# EAGLE design GroundStation_revA (EAGLE 9.6.2)

## Sheet 1 of 4: RN2483
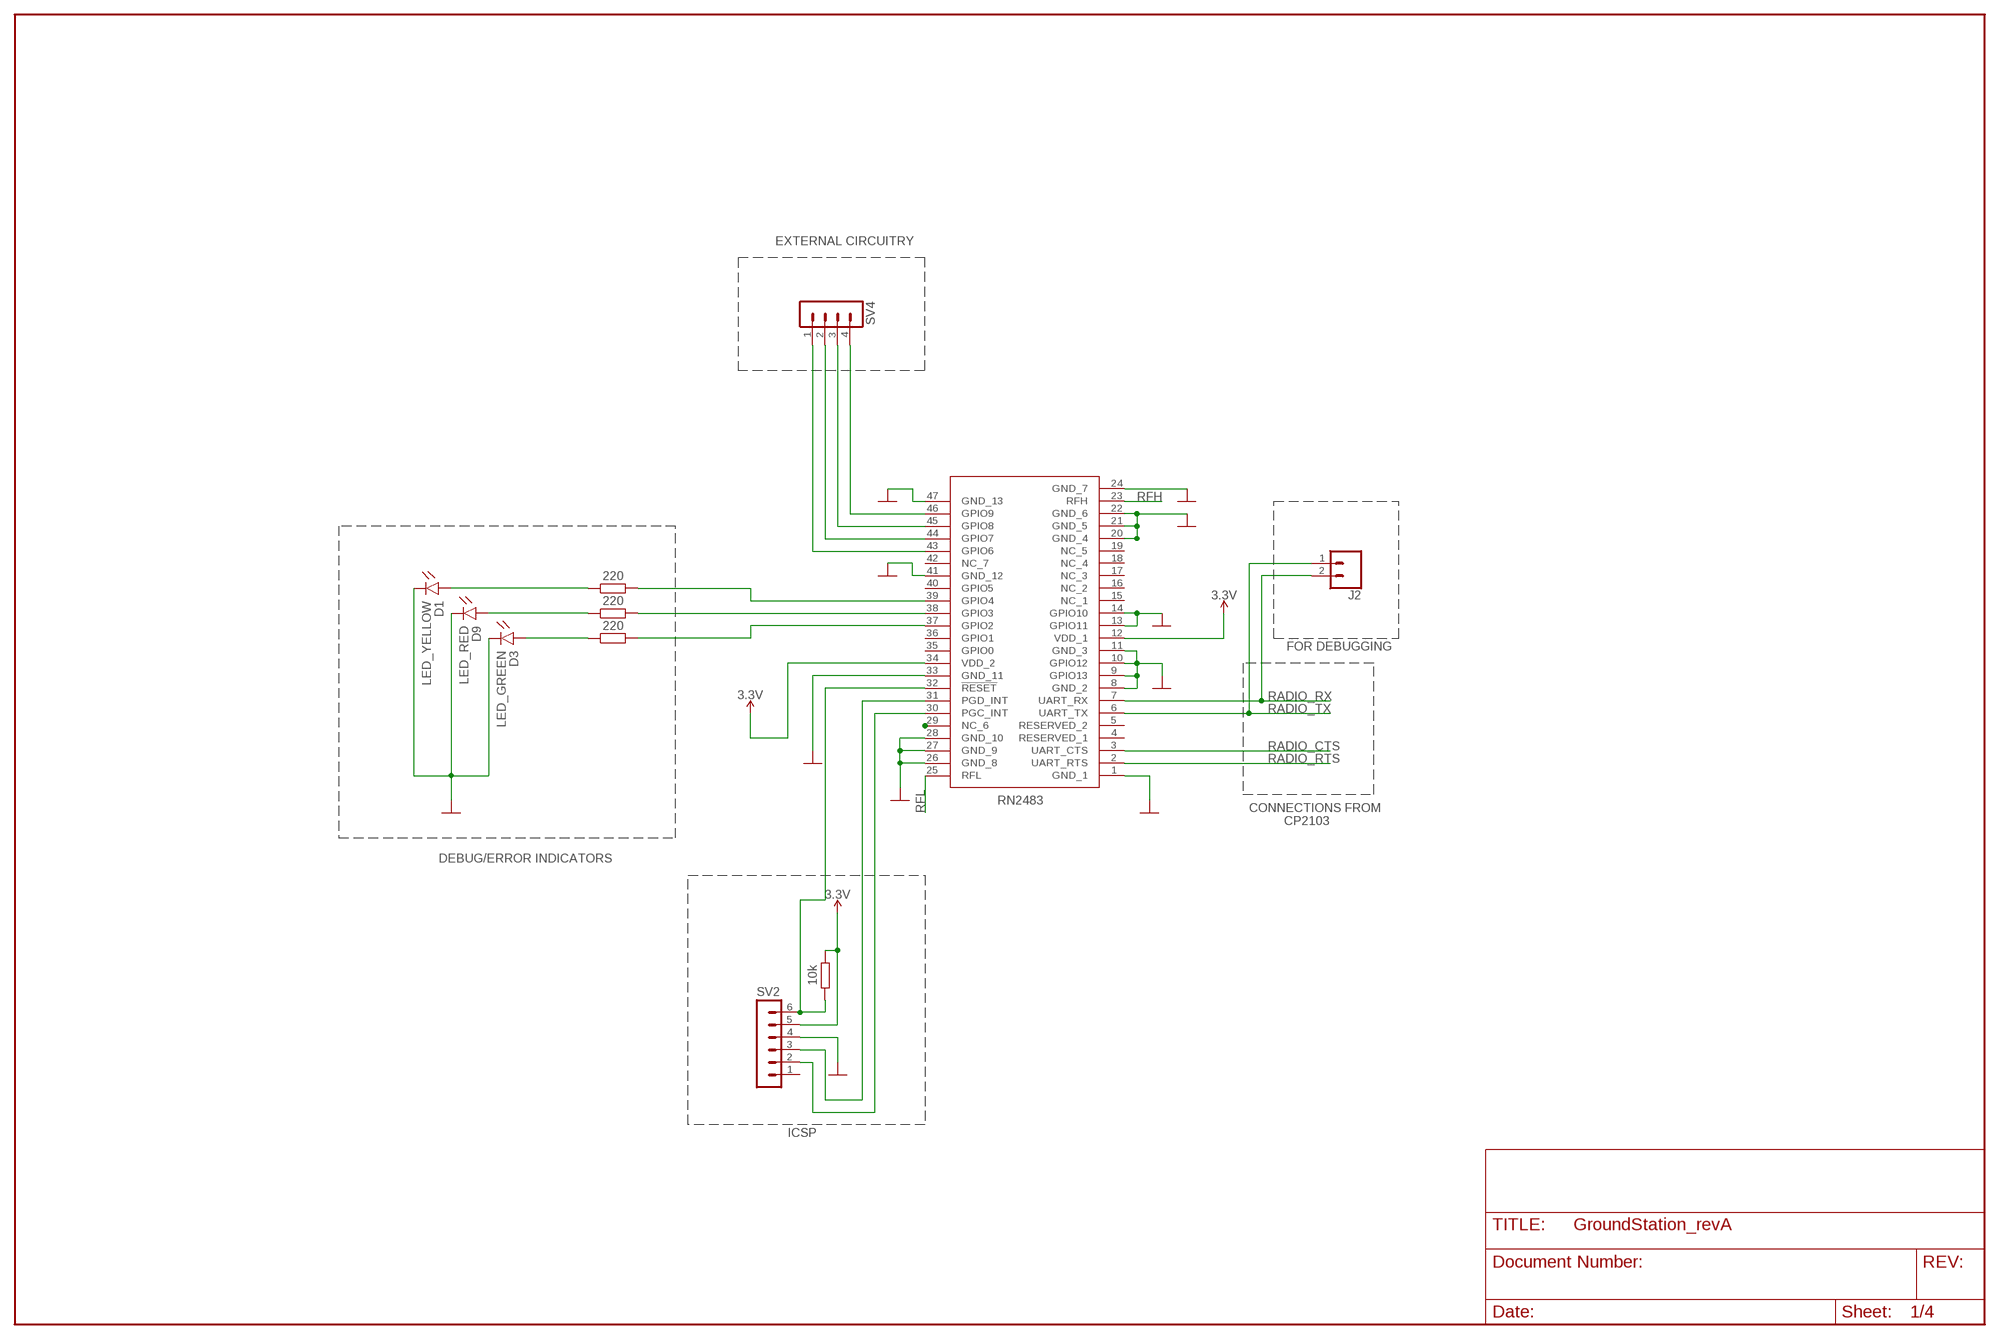
[diagram p0: schematic, sheet 1]

### Parts
D1  LED_YELLOW  CHIP-FLAT-Y_0603-0.55MM  [LEDC1608X55N_FLAT-Y]
D3  LED_GREEN  CHIP-FLAT-G_0603-0.55MM  [LEDC1608X55N_FLAT-G]
D9  LED_RED  CHIP-FLAT-R_0603-0.55MM  [LEDC1608X55N_FLAT-R]
J2  CONN_02  [1X02]
R12  10k  R_CHIP-0603(1608-METRIC)  [RESC1608X60]
R14  220  R_CHIP-0603(1608-METRIC)  [RESC1608X60]
R15  220  R_CHIP-0603(1608-METRIC)  [RESC1608X60]
R16  220  R_CHIP-0603(1608-METRIC)  [RESC1608X60]
RN2483  RN2483A-I_RM104  [RN2483AIRM104]
SV2  MA06-1  [MA06-1]
SV4  MA04-1  [MA04-1]

### Nets
3.3V: R12.1 RN2483.12(VDD_1) RN2483.34(VDD_2) SV2.5 ; also sheet 2
D2: D9.A R15.1
GND: D1.C D3.C D9.C RN2483.1(GND_1) RN2483.8(GND_2) RN2483.9(GPIO13) RN2483.10(GPIO12) RN2483.11(GND_3) RN2483.13(GPIO11) RN2483.14(GPIO10) RN2483.20(GND_4) RN2483.21(GND_5) RN2483.22(GND_6) RN2483.24(GND_7) RN2483.26(GND_8) RN2483.27(GND_9) RN2483.28(GND_10) RN2483.33(GND_11) RN2483.41(GND_12) RN2483.47(GND_13) SV2.4 ; also sheet 2,3,4
GPIO_2: R14.2 RN2483.37(GPIO2)
GPIO_3: R15.2 RN2483.38(GPIO3)
GPIO_4: R16.2 RN2483.39(GPIO4)
GPIO_6: RN2483.43(GPIO6) SV4.1
GPIO_7: RN2483.44(GPIO7) SV4.2
GPIO_8: RN2483.45(GPIO8) SV4.3
GPIO_9: RN2483.46(GPIO9) SV4.4
N$45: RN2483.29(NC_6)
N$53: D3.A R14.1
N$55: D1.A R16.1
PCG_INT: RN2483.30(PGC_INT) SV2.2
PGD_INT: RN2483.31(PGD_INT) SV2.3
RADIO_CTS: RN2483.3(UART_CTS) ; also sheet 2
RADIO_RTS: RN2483.2(UART_RTS) ; also sheet 2
RADIO_RX: J2.2 RN2483.7(UART_RX) ; also sheet 2
RADIO_TX: J2.1 RN2483.6(UART_TX) ; also sheet 2
RFH: RN2483.23(RFH) ; also sheet 4
RFL: RN2483.25(RFL) ; also sheet 4
RN2483_RESET: R12.2 RN2483.32(!RESET) SV2.6
Unconnected: RN2483.4(RESERVED_1) RN2483.5(RESERVED_2) RN2483.15(NC_1) RN2483.16(NC_2) RN2483.17(NC_3) RN2483.18(NC_4) RN2483.19(NC_5) RN2483.35(GPIO0) RN2483.36(GPIO1) RN2483.40(GPIO5) RN2483.42(NC_7) SV2.1

### Notes on the sheet
- EXTERNAL CIRCUITRY
- FOR DEBUGGING
- CONNECTIONS FROM
            CP2103
- DEBUG/ERROR INDICATORS
- ICSP

## Sheet 2 of 4: CP2103
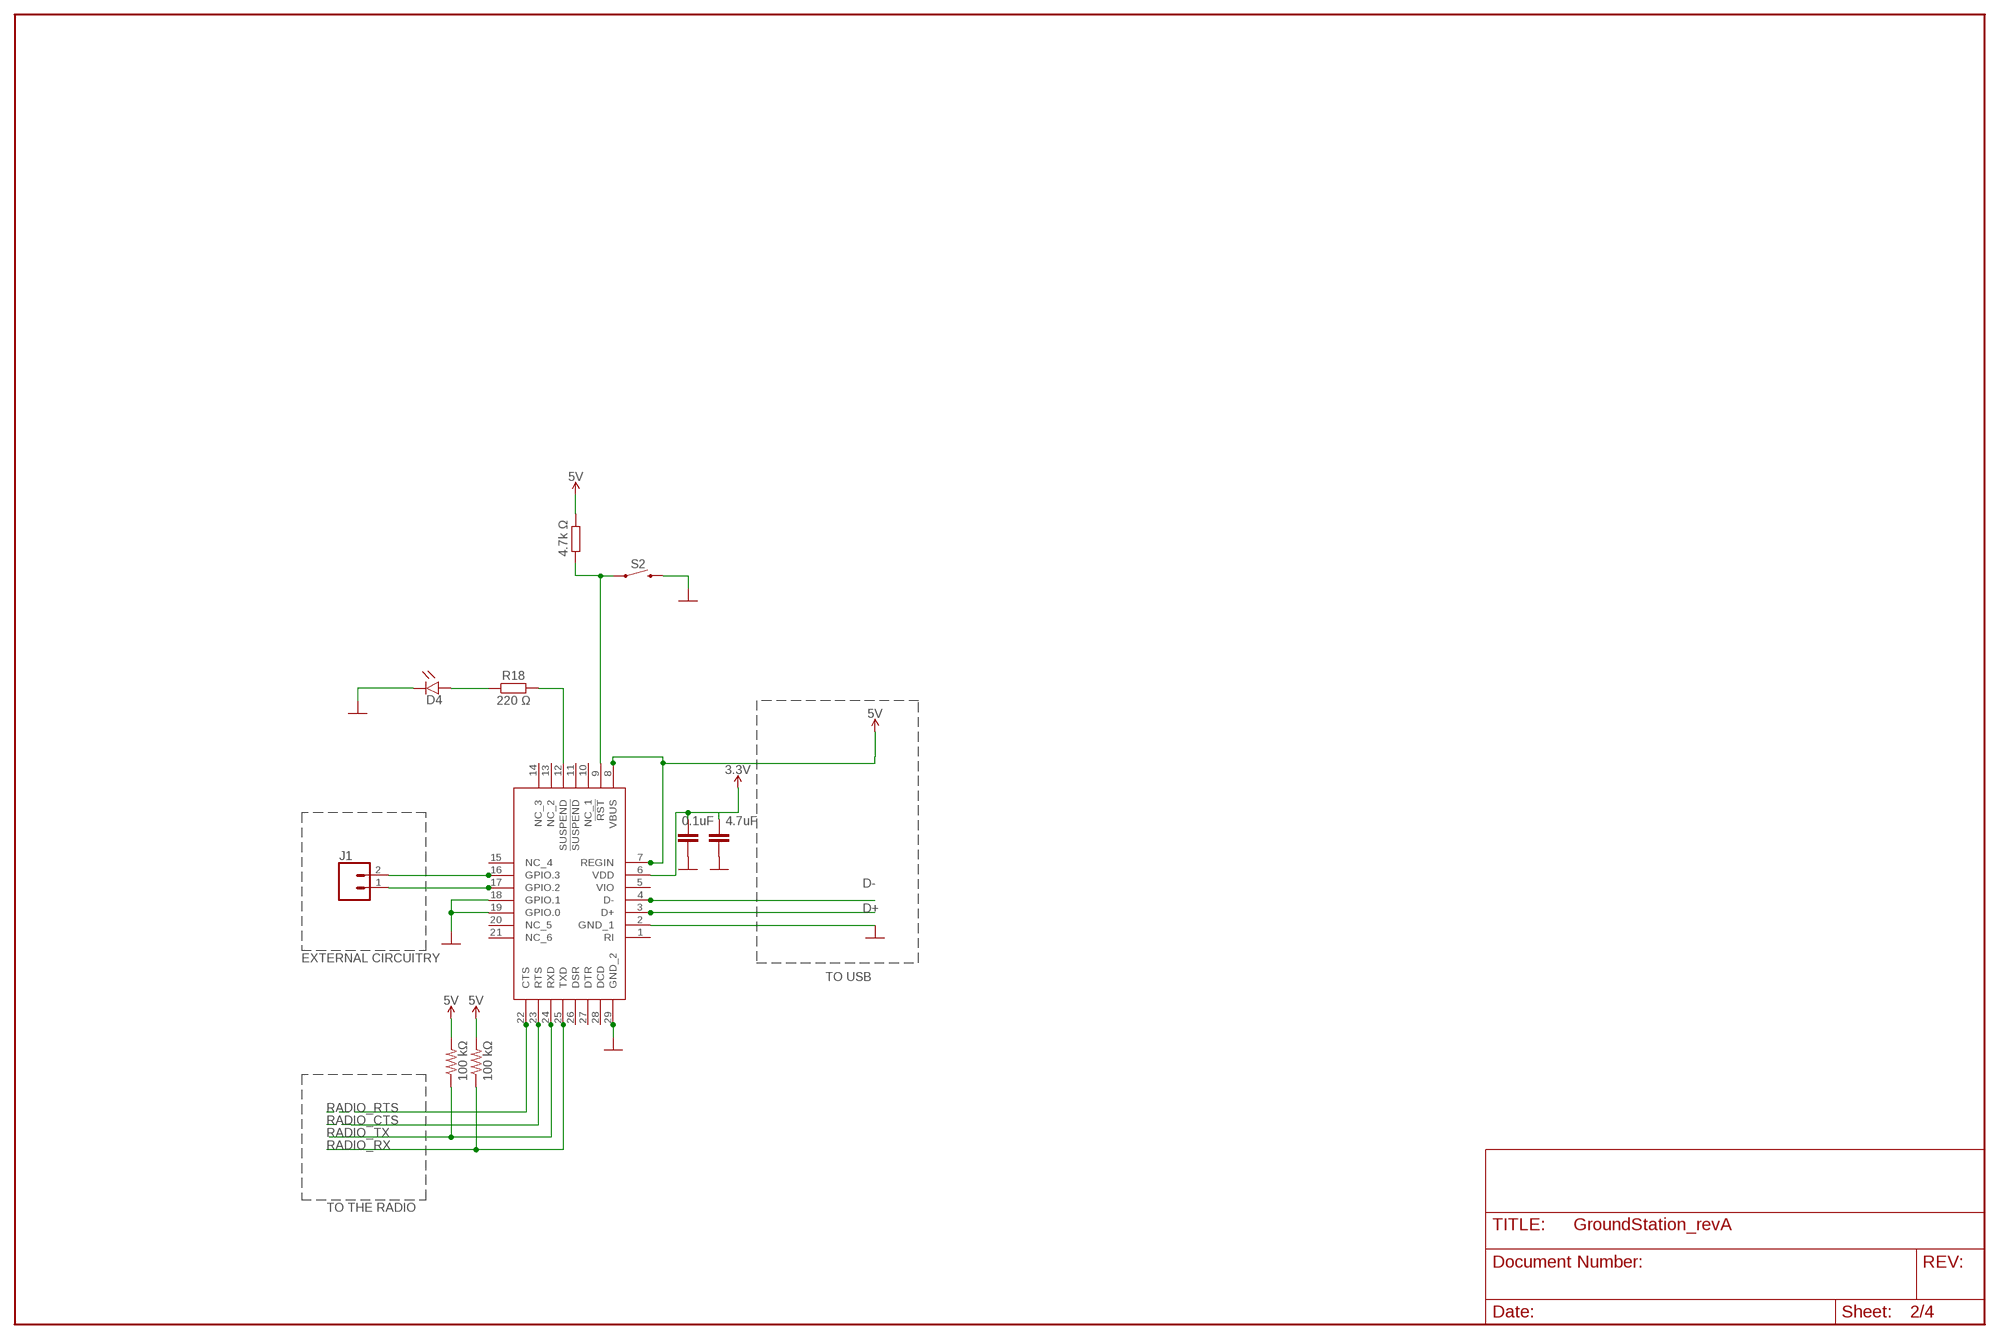
[diagram p1: schematic, sheet 2]

### Parts
C7  0.1uF  C_CHIP-0805(2012-METRIC)  [CAPC2012X110]
C9  4.7uF  C_CHIP-0805(2012-METRIC)  [CAPC2012X110]
D4  LED_RED  CHIP-FLAT-R_0603-0.55MM  [LEDC1608X55N_FLAT-R]
IC4  CP2103-GM  [QFN50P500X500X100-29N]
J1  CONN_02  [1X02]
R1  100 kΩ  R-US_R0805  [R0805]
R9  100 kΩ  R-US_R0805  [R0805]
R17  4.7k Ω  R_CHIP-0603(1608-METRIC)  [RESC1608X60]
R18  220 Ω  R_CHIP-0603(1608-METRIC)  [RESC1608X60]
S2  MOMENTARY-SWITCH-SPST-PTH-6.0MM-KIT  [TACTILE_SWITCH_PTH_6.0MM_KIT]

### Nets
3.3V: C7.1 C9.1 IC4.6(VDD) ; also sheet 1
CP2103_GPIO2: IC4.17(GPIO.2) J1.1
CP2103_GPIO3: IC4.16(GPIO.3) J1.2
CP2103_RST: IC4.9(!RST) R17.2 S2.1
D+: IC4.3(D+) ; also sheet 3
D-: IC4.4(D-) ; also sheet 3
GND: C7.2 C9.2 D4.C IC4.2(GND_1) IC4.18(GPIO.1) IC4.19(GPIO.0) IC4.29(GND_2) S2.3 ; also sheet 1,3,4
N$68: D4.A R18.1
RADIO_CTS: IC4.23(RTS) ; also sheet 1
RADIO_RTS: IC4.22(CTS) ; also sheet 1
RADIO_RX: IC4.25(TXD) R9.1 ; also sheet 1
RADIO_TX: IC4.24(RXD) R1.1 ; also sheet 1
SUSPEND: IC4.12(SUSPEND) R18.2
V_BUS: IC4.7(REGIN) IC4.8(VBUS) R1.2 R9.2 R17.1 ; supply symbol labelled 5V ; also sheet 3
Unconnected: IC4.1(RI) IC4.5(VIO) IC4.10(NC_1) IC4.11(!SUSPEND) IC4.13(NC_2) IC4.14(NC_3) IC4.15(NC_4) IC4.20(NC_5) IC4.21(NC_6) IC4.26(DSR) IC4.27(DTR) IC4.28(DCD)

### Notes on the sheet
- EXTERNAL CIRCUITRY
- TO USB
- TO THE RADIO

## Sheet 3 of 4: USB PORT
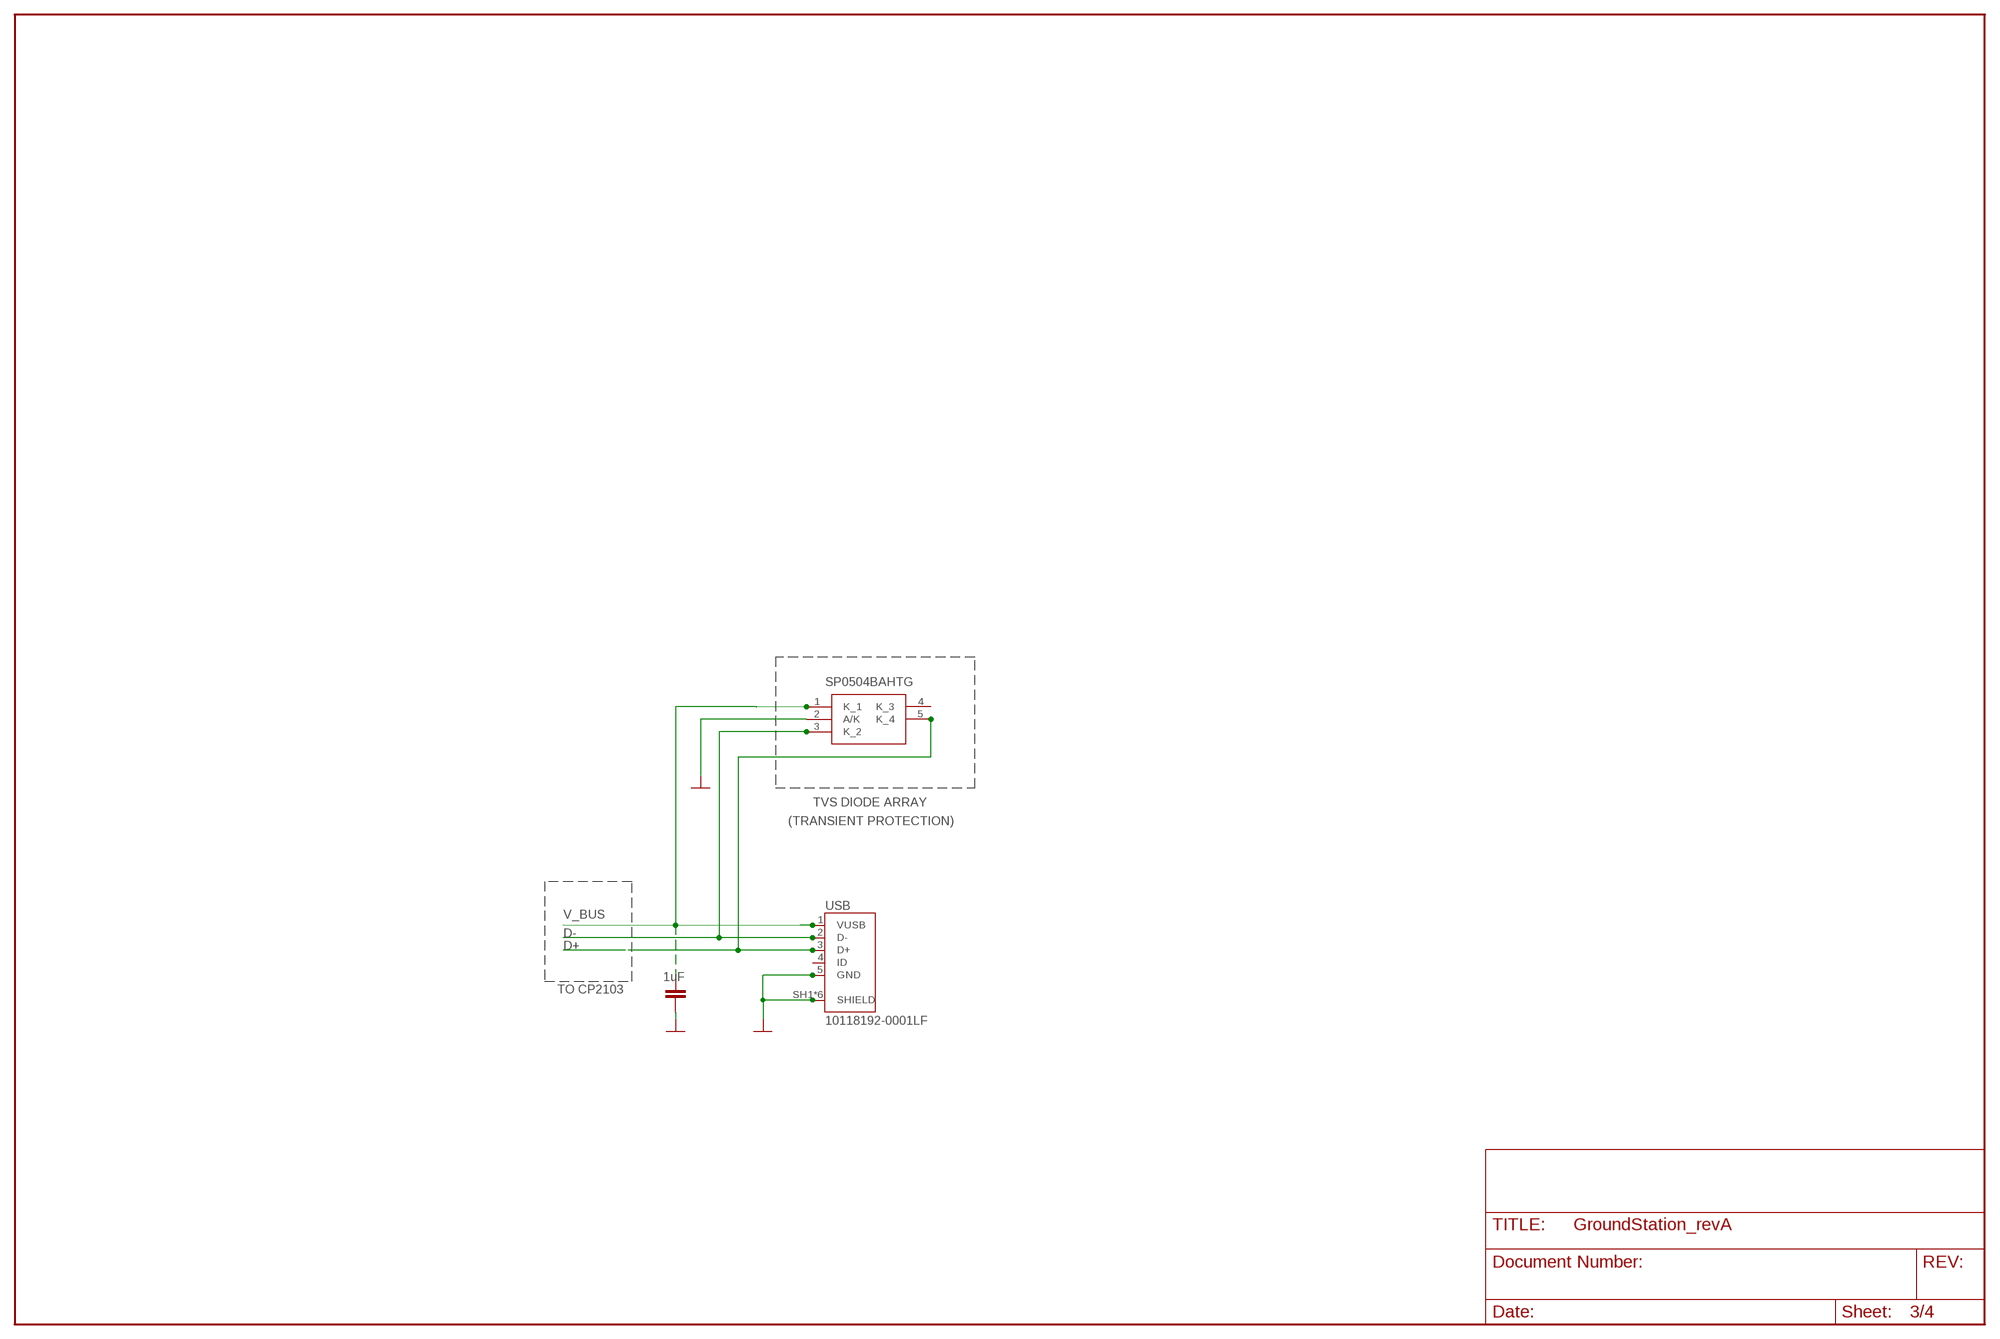
[diagram p2: schematic, sheet 3]

### Parts
C8  1uF  C_CHIP-0805(2012-METRIC)  [CAPC2012X110]
IC6  SP0504BAHTG  [SOT95P280X145-5N]
USB  10118192-0001LF  [10118192-0001LF]

### Nets
D+: IC6.5(K_4) USB.3(D+) ; also sheet 2
D-: IC6.3(K_2) USB.2(D-) ; also sheet 2
GND: C8.2 IC6.2(A/K) USB.5(GND) USB.SH1(SHIELD) USB.SH2(SHIELD) USB.SH3(SHIELD) USB.SH4(SHIELD) USB.SH5(SHIELD) USB.SH6(SHIELD) ; also sheet 1,2,4
V_BUS: C8.1 IC6.1(K_1) USB.1(VUSB) ; also sheet 2
Unconnected: IC6.4(K_3) USB.4(ID)

### Notes on the sheet
- TVS DIODE ARRAY
- (TRANSIENT PROTECTION)
- TO CP2103

## Sheet 4 of 4: SMA CONNECTORS
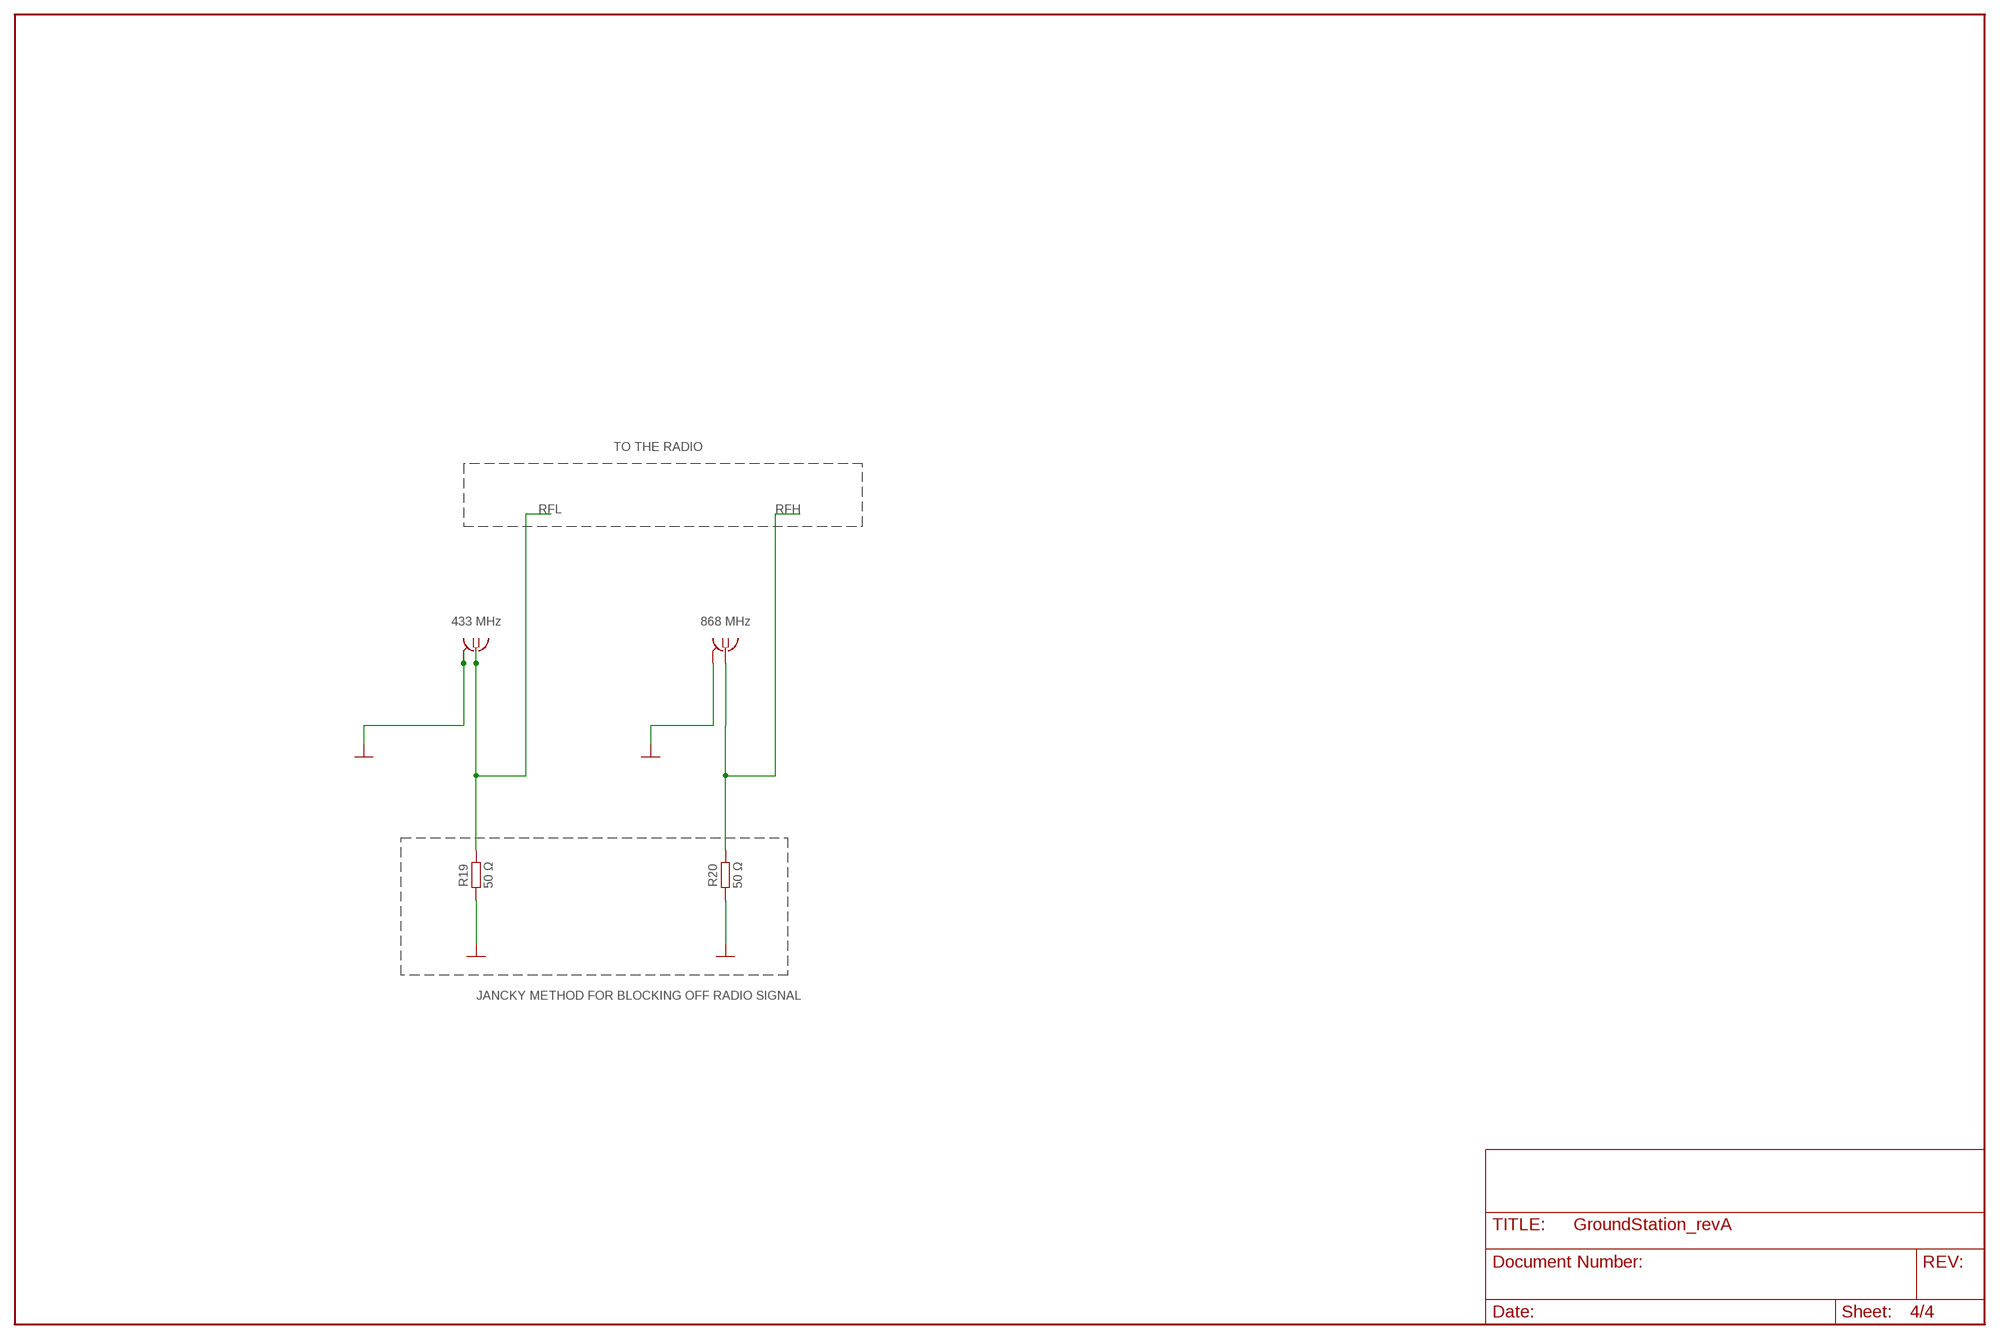
[diagram p3: schematic, sheet 4]

### Parts
ANT1  5MMSMA  [5MMSMA]
ANT2  5MMSMA  [5MMSMA]
R19  50 Ω  R_CHIP-0603(1608-METRIC)  [RESC1608X60]
R20  50 Ω  R_CHIP-0603(1608-METRIC)  [RESC1608X60]

### Nets
GND: ANT1.GND ANT1.GND2(GND) ANT2.GND ANT2.GND2(GND) R19.1 R20.1 ; also sheet 1,2,3
RFH: ANT2.RF R20.2 ; also sheet 1
RFL: ANT1.RF R19.2 ; also sheet 1

### Notes on the sheet
- TO THE RADIO
- 433 MHz | 868 MHz
- JANCKY METHOD FOR BLOCKING OFF RADIO SIGNAL

## Library data of the parts
ANT1 ANT2 = CUINSPACE_Managed:5MMSMA
C7-C9 = Capacitor:C: Capacitor - Generic; CATEGORY: Capacitor
D1 = LED:CHIP-FLAT-Y; CATEGORY: LED; COLOR: YELLOW; DESCRIPTION: CHIP LED FLAT; SUB-CATEGORY: CHIP; TYPE: FLAT_TOP
D3 = LED:CHIP-FLAT-G; CATEGORY: LED; COLOR: GREEN; DESCRIPTION: CHIP LED FLAT; SUB-CATEGORY: CHIP; TYPE: FLAT_TOP
D4 D9 = LED:CHIP-FLAT-R; CATEGORY: LED; COLOR: RED; DESCRIPTION: CHIP LED FLAT; SUB-CATEGORY: CHIP; TYPE: FLAT_TOP
IC4 = CP2103-GM:CP2103-GM: IC,Converter,USB - UART Bridge,CP2103-GM Silicon Labs CP2103-GM, USB Controller, 12MBps, USB to UART, 3.3 V, 28-Pin QFN Source: Datasheet <https://www.silabs.com/documents/public/data-sheets/CP2103.pdf>; ARROW_PART_NUMBER: CP2103-GM; ARROW_PRICE-STOCK: https://www.arrow.com/en/products/cp2103-gm/silicon-labs?region=nac; DESCRIPTION: IC,Converter,USB - UART Bridge,CP2103-GM Silicon Labs CP2103-GM, USB Controller, 12MBps, USB to UART, 3.3 V, 28-Pin QFN; HEIGHT: 1mm; MANUFACTURER_NAME: Silicon Labs; MANUFACTURER_PART_NUMBER: CP2103-GM; MOUSER_PART_NUMBER: 634-CP2103-GM; MOUSER_PRICE-STOCK: https://www.mouser.co.uk/ProductDetail/Silicon-Labs/CP2103-GM?qs=yHCtFi5ROqIZGxXx3OFcgw%3D%3D
IC6 = SP0504BAHTG:SP0504BAHTG: Littelfuse SP0504BAHTG Quad Uni-Directional TVS Diode Array, 0.225W peak, 5-Pin SOT-23 Source: Datasheet <http://componentsearchengine.com/Datasheets/1/SP0504BAHTG.pdf>; ARROW_PART_NUMBER: SP0504BAHTG; ARROW_PRICE-STOCK: https://www.arrow.com/en/products/sp0504bahtg/littelfuse; DESCRIPTION: Littelfuse SP0504BAHTG Quad Uni-Directional TVS Diode Array, 0.225W peak, 5-Pin SOT-23; HEIGHT: 1.45mm; MANUFACTURER_NAME: LITTELFUSE; MANUFACTURER_PART_NUMBER: SP0504BAHTG; MOUSER_PART_NUMBER: 576-SP0504BAHTG; MOUSER_PRICE-STOCK: https://www.mouser.co.uk/ProductDetail/Littelfuse/SP0504BAHTG?qs=zR8PVLWe1trv9sWzoBaD%252Bg%3D%3D
J1 J2 = SparkFun-Connectors:CONN_02: Multi connection point. Often used as Generic Header-pin footprint for 0.1 inch spaced/style header connections On any of the 0.1 inch spaced packages, you can populate with these: Break Away Headers - Straight <https://www.sparkfun.com/products/116> (PRT-00116) Break Away Male Headers - Right Angle <https://www.sparkfun.com/products/553> (PRT-00553) Female Headers <https://www.sparkfun.com/products/115> (PRT-00115) Break Away Headers - Machine Pin <https://www.sparkfun.com/products/117> (PRT-00117) Break Away Female Headers - Swiss Machine Pin <https://www.sparkfun.com/products/743> (PRT-00743) For SCREWTERMINALS and SPRING TERMINALS visit here: Screw Terimnals on SparkFun.com <https://www.sparkfun.com/search/results?term=Screw+Terminals> (5mm/3.5mm/2.54mm spacing) This device is also useful as a general connection point to wire up your design to another part of your project. Our various solder wires solder well into these plated through hole pads. Hook-Up Wire - Assortment (Stranded, 22 AWG) <https://www.sparkfun.com/products/11375> (PRT-11375) Hook-Up Wire - Assortment (Solid Core, 22 AWG) <https://www.sparkfun.com/products/11367> (PRT-11367) View the entire wire category on our website here <https://www.sparkfun.com/categories/141> Special notes: Molex polarized connector foot print use with: PRT-08233 with associated crimp pins and housings. 2.54_SCREWTERM for use with PRT-10571. 3.5mm Screw Terminal footprints for PRT-08084 5mm Screw Terminal footprints for use with PRT-08432
R1 R9 = rcl:R-US_: RESISTOR, American symbol; SPICEPREFIX: R
R12 R14-R20 = Resistor:R: Resistor Fixed - Generic; CATEGORY: Resistor; SUB-CATEGORY: Fixed
RN2483 = RN2483A-I_RM104:RN2483A-I_RM104: MICROCHIP - RN2483A-I/RM104 - TRANSCEIVER MODULE, 300KBPS, 870MHZ Source: Datasheet <https://www.arrow.com/en/products/rn2483a-irm104/microchip-technology>; ARROW_PART_NUMBER: RN2483A-I/RM104; ARROW_PRICE-STOCK: https://www.arrow.com/en/products/rn2483a-irm104/microchip-technology?region=nac; DESCRIPTION: MICROCHIP - RN2483A-I/RM104 - TRANSCEIVER MODULE, 300KBPS, 870MHZ; HEIGHT: 3.34mm; MANUFACTURER_NAME: Microchip; MANUFACTURER_PART_NUMBER: RN2483A-I/RM104; MOUSER_PART_NUMBER: 579-RN2483A-I/RM104; MOUSER_PRICE-STOCK: https://www.mouser.co.uk/ProductDetail/Microchip-Technology/RN2483A-I-RM104?qs=F5EMLAvA7ICI%2FFS0wekTjA%3D%3D
S2 = SparkFun-Switches:MOMENTARY-SWITCH-SPST: Momentary Switch (Pushbutton) - SPST Normally-open (NO) SPST momentary switches (buttons, pushbuttons). Variants PTH-12MM - 12mm square, through-hole Momentary Pushbutton Switch - 12mm Square <https://www.sparkfun.com/products/9190> (COM-09190) PTH-6.0MM, PTH-6.0MM-KIT - 6.0mm square, through-hole Mini Pushbutton Switch <https://www.sparkfun.com/products/97> (COM-00097) KIT package intended for soldering kit's - only one side of pads' copper is exposed. PTH-RIGHT-ANGLE-KIT - Right-angle, through-hole Right Angle Tactile Button <https://www.sparkfun.com/products/10791> - Used on SparkFun BigTime Watch Kit <https://www.sparkfun.com/products/11734> SMD-12MM - 12mm square, surface-mount Tactile Button - SMD (12mm) <https://www.sparkfun.com/products/12993> (COM-12993) Used on SparkFun PicoBoard <https://www.sparkfun.com/products/11888> SMD-4.5MM - 4.5mm Square Trackball Switch Used on SparkFun Blackberry Trackballer Breakout <https://www.sparkfun.com/products/13169> SMD-4.6MMX2.8MM - 4.60mm x 2.80mm, surface mount Used on SparkFun SAMD21 Mini Breakout <https://www.sparkfun.com/products/13664> SMD-5.2MM, SMD-5.2-REDUNDANT - 5.2mm square, surface-mount Mini Pushbutton Switch - SMD <https://www.sparkfun.com/products/8720> (COM-08720) Used on Arduino Pro Mini <https://www.sparkfun.com/products/11114> REDUNDANT package connects both switch circuits together SMD-6.0X3.5MM - 6.0 x 3.5mm, surface mount Momentary Reset Switch SMD <https://www.sparkfun.com/products/8229> (COM-08229) SMD-6.2MM-TALL - 6.2mm square, surface mount Tactile Button - SMD (6mm) <https://www.sparkfun.com/products/12992> Used on SparkFun Digital Sandbox <https://www.sparkfun.com/products/12651> SMD-RIGHT-ANGLE - Right-angle, surface mount Used on SparkFun Block for Intel® Edison - Arduino <https://www.sparkfun.com/products/13036>; PROD_ID: SWCH-08441; SF_SKU: COM-00097
SV2 = con-lstb:MA06-1: PIN HEADER; OC_FARNELL: unknown; OC_NEWARK: unknown
SV4 = con-lstb:MA04-1: PIN HEADER; OC_FARNELL: unknown; OC_NEWARK: unknown
USB = MCU Board:10118192-0001LF

## Board
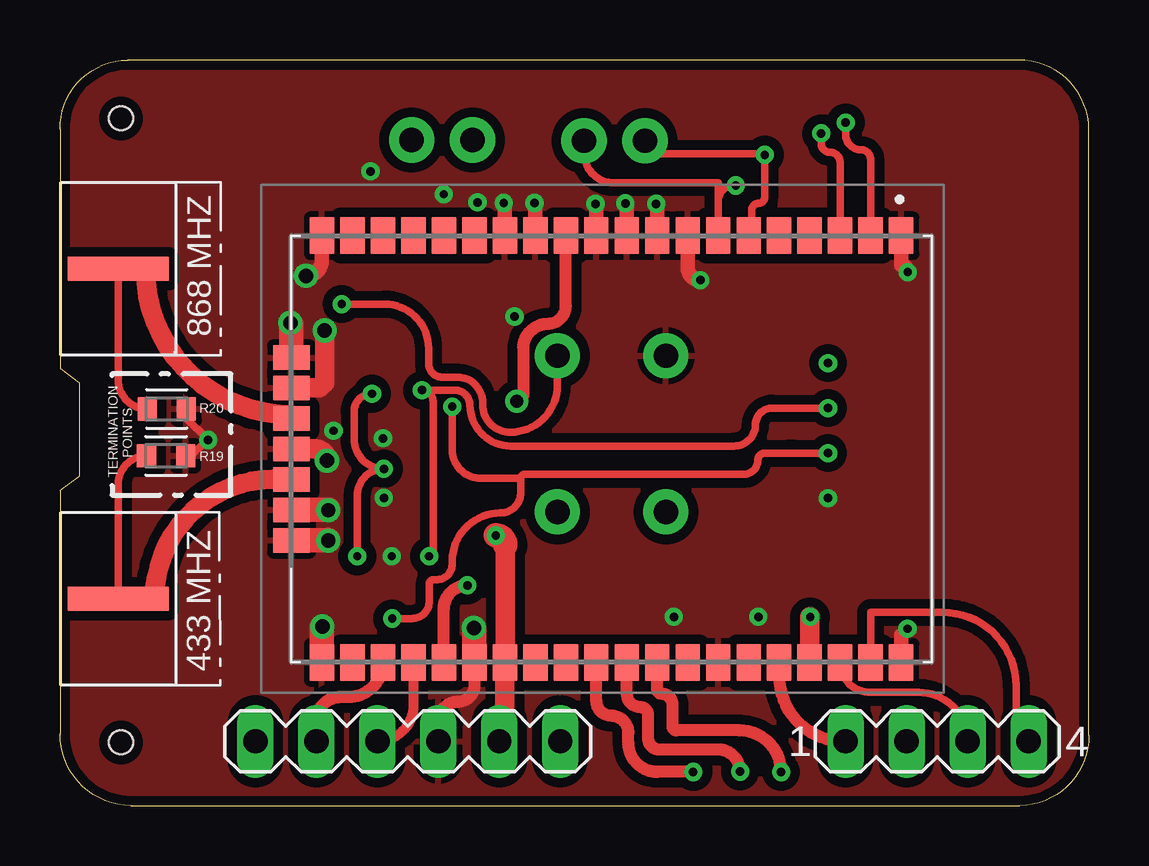
[diagram p4: board, top side]
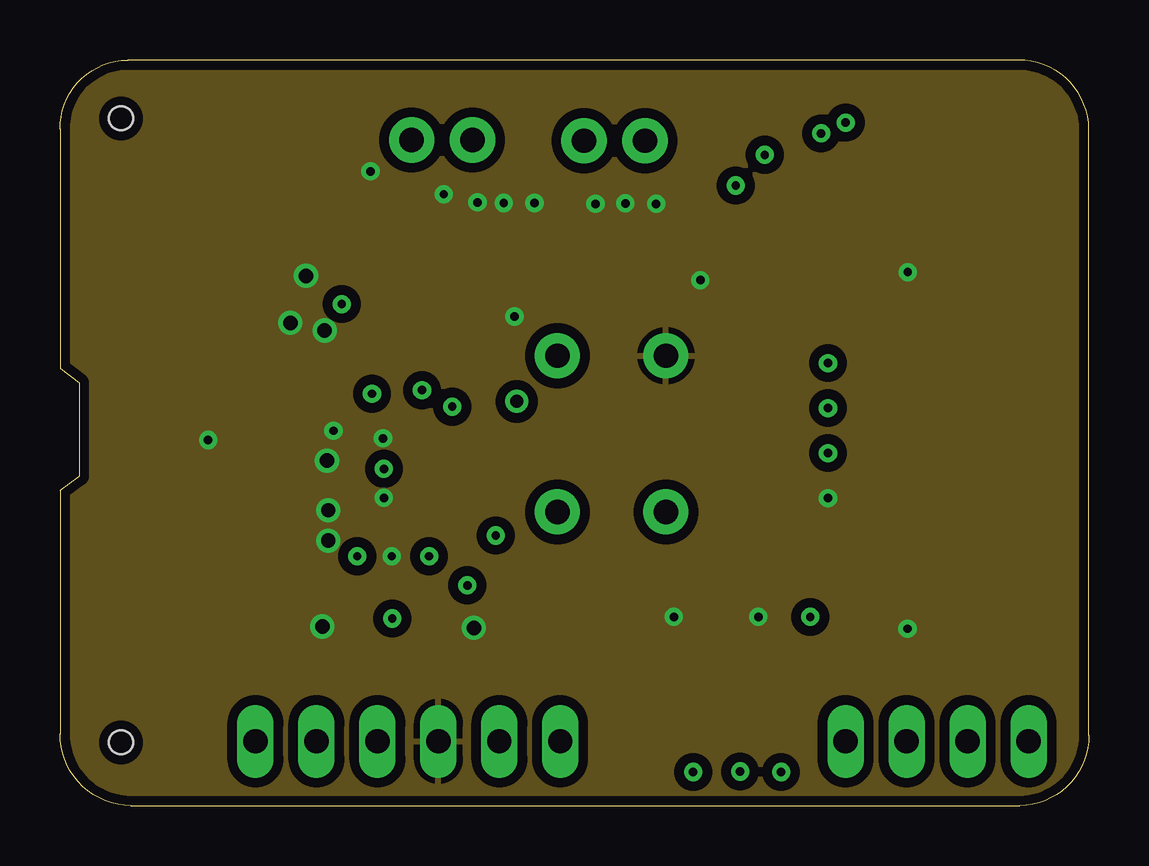
[diagram p5: board, inner layer Route2]
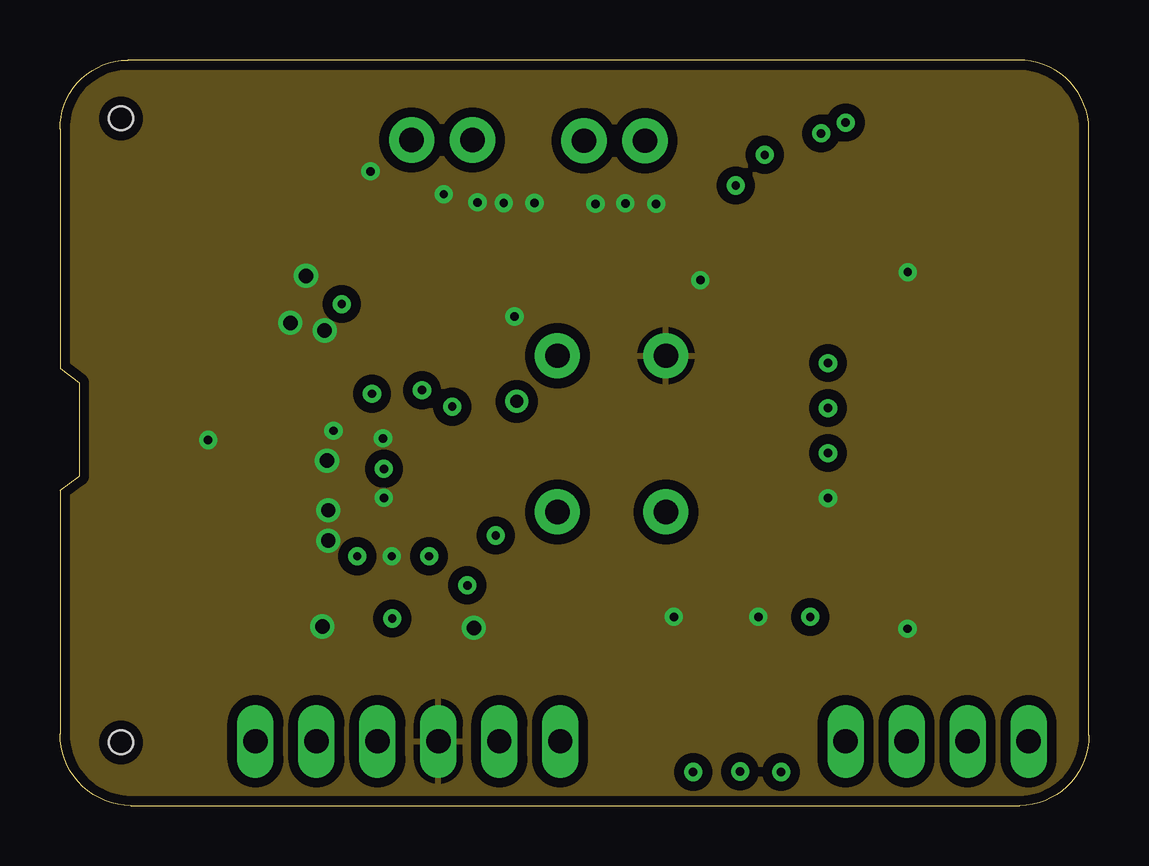
[diagram p6: board, inner layer Route15]
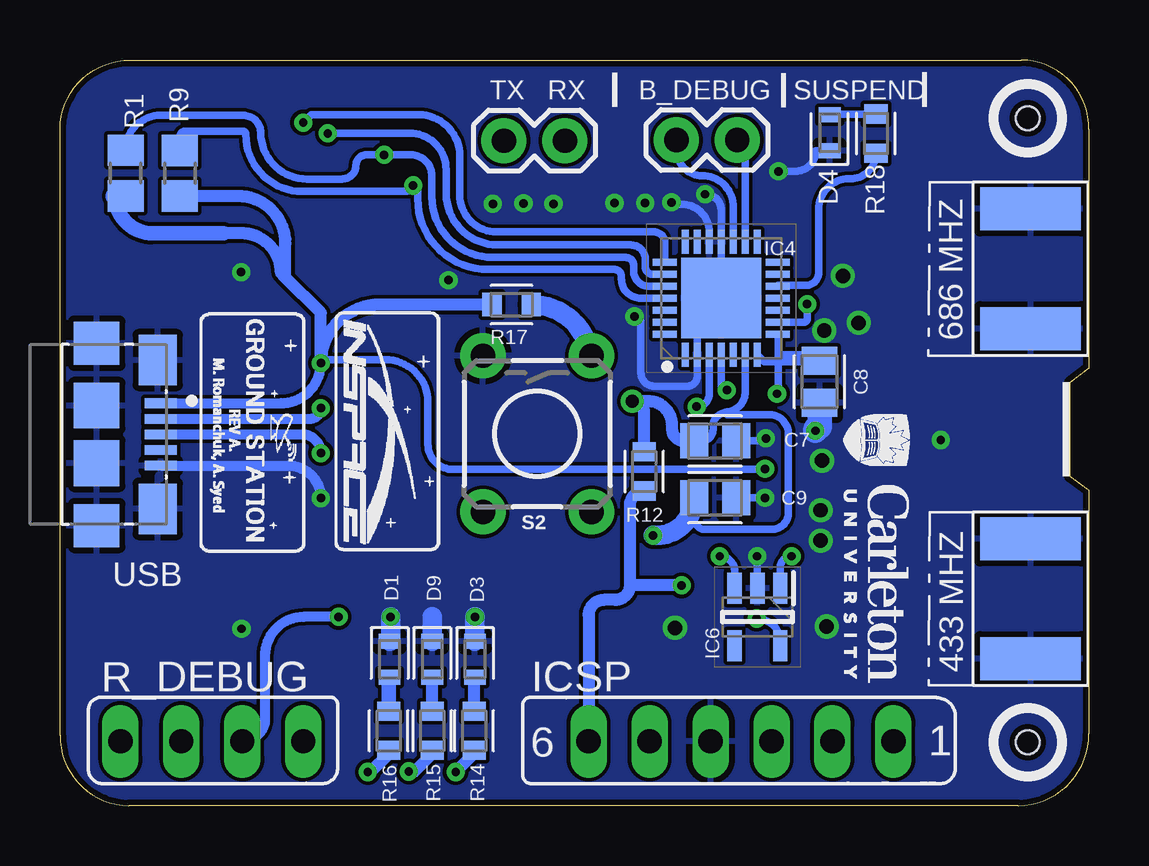
[diagram p7: board, bottom side, seen from below]

Size 42.87 x 31.07 mm. Coordinates in mm from the lower left corner, seen from the top.
Outline: 2.95,0 40,0 arc90 42.87,2.94 42.87,28.18 arc90 39.94,31.07 2.82,31.07 arc90 0,28.18 0,18.22 0.8,17.63 0.8,13.72 0,13.14 0,3 arc90 2.95,0
Copper layers (1+2*15+16): Top 0.035mm / dielectric 0.02mm / Route2 0.035mm / dielectric 1.42mm / Route15 0.035mm / dielectric 0.02mm / Bottom 0.035mm
Design rules "default *": minimum track width 6mil, minimum drill 0.35mm, track to track 6mil, track to pad 6mil, pad to pad 6mil, via to via 6mil, smd to smd 6mil, copper to edge 10mil, drill to drill 6mil, minimum pad ring 10mil, minimum via ring 8mil, stop-mask expansion 4mil, vias tented up to drill 0mil, thermal gap 10mil
Holes 1 mm at 2.55,28.64 2.55,2.64

### Footprints (pad centres in the part's own frame; a part is rotated, then mirrored left to right if it is on the bottom)
5MMSMA = smd 1.8 x 4.2 bottom: GND 2.5,0; GND2 -2.5,0 | smd 1 x 4.2: RF 0,0
CAPC2012X110 = smd 1.165 x 1.465: 1 -0.875,0; 2 0.875,0
LEDC1608X55N_FLAT-Y = smd 0.612 x 0.912: A 0.75,0; C -0.75,0
LEDC1608X55N_FLAT-G = smd 0.612 x 0.912: A 0.75,0; C -0.75,0
LEDC1608X55N_FLAT-R = smd 0.612 x 0.912: A 0.75,0; C -0.75,0
QFN50P500X500X100-29N = smd 1 x 0.3: 1 -2.35,1.5; 2 -2.35,1; 3 -2.35,0.5; 4 -2.35,0; 5 -2.35,-0.5; 6 -2.35,-1; 7 -2.35,-1.5; 15 2.35,-1.5; 16 2.35,-1; 17 2.35,-0.5; 18 2.35,0; 19 2.35,0.5; 20 2.35,1; 21 2.35,1.5 | smd 0.3 x 1: 8 -1.5,-2.35; 9 -1,-2.35; 10 -0.5,-2.35; 11 0,-2.35; 12 0.5,-2.35; 13 1,-2.35; 14 1.5,-2.35; 22 1.5,2.35; 23 1,2.35; 24 0.5,2.35; 25 0,2.35; 26 -0.5,2.35; 27 -1,2.35; 28 -1.5,2.35 | smd 3.35 x 3.35: 29 0,0
SOT95P280X145-5N = smd 1.3 x 0.6: 1 -1.2,0.95; 2 -1.2,0; 3 -1.2,-0.95; 4 1.2,-0.95; 5 1.2,0.95
1X02 = drill 1.016 pad 1.88: 1 0,0; 2 2.54,0
R0805 = smd 1.3 x 1.5: 1 -0.95,0; 2 0.95,0
RESC1608X60 = smd 0.799 x 0.974: 1 -0.815,0; 2 0.815,0
RN2483AIRM104 = smd 1.524 x 1.016: 1 8.89,-12.065; 2 8.89,-10.795; 3 8.89,-9.525; 4 8.89,-8.255; 5 8.89,-6.985; 6 8.89,-5.715; 7 8.89,-4.445; 8 8.89,-3.175; 9 8.89,-1.905; 10 8.89,-0.635; 11 8.89,0.635; 12 8.89,1.905; 13 8.89,3.175; 14 8.89,4.445; 15 8.89,5.715; 16 8.89,6.985; 17 8.89,8.255; 18 8.89,9.525; 19 8.89,10.795; 20 8.89,12.065; 28 -8.89,12.065; 29 -8.89,10.795; 30 -8.89,9.525; 31 -8.89,8.255; 32 -8.89,6.985; 33 -8.89,5.715; 34 -8.89,4.445; 35 -8.89,3.175; 36 -8.89,1.905; 37 -8.89,0.635; 38 -8.89,-0.635; 39 -8.89,-1.905; 40 -8.89,-3.175; 41 -8.89,-4.445; 42 -8.89,-5.715; 43 -8.89,-6.985; 44 -8.89,-8.255; 45 -8.89,-9.525; 46 -8.89,-10.795; 47 -8.89,-12.065 | smd 1.016 x 1.524: 21 3.81,13.335; 22 2.54,13.335; 23 1.27,13.335; 24 0,13.335; 25 -1.27,13.335; 26 -2.54,13.335; 27 -3.81,13.335
TACTILE_SWITCH_PTH_6.0MM_KIT = drill 1.016 pad 1.88: 1 -3.251,2.261; 2 3.251,2.261; 3 -3.251,-2.261; 4 3.251,-2.261
MA06-1 = drill 1.016 long: 1 -6.35,0; 2 -3.81,0; 3 -1.27,0; 4 1.27,0; 5 3.81,0; 6 6.35,0
MA04-1 = drill 1.016 long: 1 -3.81,0; 2 -1.27,0; 3 1.27,0; 4 3.81,0
10118192-0001LF = smd 0.4 x 1.35: 1 -1.3,2.54; 2 -0.65,2.54; 3 0,2.54; 4 0.65,2.54; 5 1.3,2.54 | smd 2.1 x 1.6: SH1 -3.1,2.415; SH2 3.1,2.415 | smd 1.8 x 1.9: SH3 -3.8,-0.135; SH6 3.8,-0.135 | smd 1.9 x 1.9: SH4 -1.2,-0.135; SH5 1.2,-0.135

### Placement (x,y rotation side)
ANT1  2.43,8.62 90 top
ANT2  2.43,22.37 90 top
C7  15.58,15.2 0 bottom
C8  11.22,17.66 270 bottom
C9  15.58,12.83 0 bottom
D1  29.14,6.1 270 bottom
D3  25.58,6.1 270 bottom
D4  10.8,28.04 90 bottom
D9  27.37,6.1 270 bottom
IC4  15.32,21.15 90 bottom
IC6  13.81,7.86 270 bottom
J1  17.19,27.74 0 bottom
J2  24.38,27.71 0 bottom
R1  40.14,26.35 270 bottom
R9  37.87,26.35 270 bottom
R12  18.53,13.93 270 bottom
R14  25.61,3.12 270 bottom
R15  27.36,3.12 270 bottom
R16  29.17,3.12 270 bottom
R17  24.05,20.88 0 bottom
R18  8.87,28 270 bottom
R19  4.42,14.58 180 top
R20  4.45,16.53 180 top
RN2483  22.98,14.86 90 top
S2  22.99,15.49 270 bottom
SV2  14.49,2.68 0 top
SV4  36.55,2.68 0 top
USB  41.21,15.47 270 bottom

### Tracks (layer width: path | path; a pad name or v marks a point on that pad's centre or on a via)
3.3V  (via drill 0.35, 0.55)
  Top 0.406: 18.54,2.91 arc-90 SV2.5
  Top 0.508: v19.03,16.85 19.31,17.12 19.31,19.05 arc-90 20.33,20.08 arc90 21.08,20.82 RN2483.12
  Top 0.813: 18.55,10.86 18.55,5.99 arc-90 RN2483.34 18.54,2.91 arc-90 SV2.5
  Top 1.016: v18.16,11.26 arc-90 18.55,10.86
  Bottom 0.305: IC4.6 14.32,17.24 arc90 15.16,16.4 15.12,16.36 | 15.12,16.36 arc-90 15.05,16.3 13.33,16.3 arc90 12.52,15.49 12.52,12.2 arc90 13.22,11.51 15.97,11.51 arc90 16.45,11.99 C9.1 | 15.12,16.36 arc-90 15.66,15.82 15.66,15.67 arc90 16.13,15.2 C7.1
  Bottom 0.508: C7.1 16.87,15.2 arc90 17.37,15.69 17.37,15.87 arc-90 18.34,16.85 v19.03,16.85 arc90 18.53,16.34 R12.1
  Bottom 0.813: v18.16,11.26 18.03,11.26 arc-90 C9.1
CP2103_GPIO2
  Bottom 0.305: IC4.17 14.82,24.95 arc-90 16.12,26.25 arc90 17.19,27.32 J1.1
CP2103_GPIO3
  Bottom 0.305: J1.2 arc90 14.32,27.4 IC4.16
CP2103_RST  (via drill 0.35)
  Top 0.305: v11.74,20.9 13.52,20.9 arc-90 15.36,19.06 15.36,18.41 arc90 15.92,17.85 16.55,17.85 arc-90 17.61,16.79 17.61,16.7 arc90 18.76,15.56 arc90 20.73,17.53 S2.1
  Bottom 0.305: IC4.9 11.87,20.15 arc-90 11.74,20.28 v11.74,20.9
  Bottom 0.813: R17.2 arc90 20.73,18.36 S2.1
D2
  Bottom 0.508: R15.1 D9.A
D+  (via drill 0.35)
  Top 0.305: v13.84,7.8 14.67,7.8 arc90 15.39,8.51 15.39,9.23 arc-90 15.57,9.41 15.68,9.41 arc90 16.34,10.07 16.34,10.19 arc-90 18.35,12.19 arc90 19.2,13.05 19.2,13.64 | v16.35,16.62 16.35,14.82 arc90 17.53,13.64 19.2,13.64 | v32,14.69 30.58,14.69 30.36,14.69 29.37,14.69 arc90 29.08,14.4 arc-90 28.48,13.81 28.28,13.81 28.12,13.81 19.37,13.81 arc90 19.2,13.64
  Bottom 0.305: v16.35,16.62 arc-90 15.82,17.15 IC4.3 | IC6.5 12.86,6.81 arc-90 v13.84,7.8
  Bottom 0.406: v32,14.69 arc-90 32.78,15.47 USB.3
D-  (via drill 0.35)
  Top 0.305: v15.38,10.39 15.56,10.57 arc-90 15.54,10.59 15.54,16.85 arc90 v15.08,17.31 16.45,17.31 arc-90 17.08,16.68 arc90 18.78,14.99 28.09,14.99 arc90 28.97,15.87 arc-90 29.67,16.56 v32,16.56
  Bottom 0.305: IC4.4 15.32,17.54 arc-90 v15.08,17.31 | IC6.3 14.76,9.77 arc-90 v15.38,10.39
  Bottom 0.406: v32,16.56 arc90 32.45,16.12 USB.2
GND  (via drill 0.35, 0.6)
  Top 0.305: R20.1 5.26,16.14 v6.17,15.24 5.42,14.58 R19.1
  Top 0.508: RN2483.33 17.27,5.01 arc-90 16.59,4.33 arc90 15.76,3.51 SV2.4
  Top 0.61: RN2483.1 35.05,22.51 arc-90 v35.32,22.23 | RN2483.14 18.54,25.06 arc90 v18.49,25.11 | RN2483.13 19.81,25.07 arc90 v19.77,25.11 | RN2483.11 22.35,25.04 arc90 v22.31,25.08 | RN2483.10 23.62,25.03 arc90 v23.56,25.09 | RN2483.9 24.89,25.03 arc90 v24.84,25.08 | RN2483.8 26.16,22.42 arc90 v26.68,21.9 | RN2483.20 10.92,22.74 arc-90 v10.25,22.08 | RN2483.47 35.05,7.1 v35.31,7.37
  Top 0.813: v11.03,19.8 11.03,17.62 10.81,17.4 RN2483.22 | RN2483.24 10.64,14.86 arc-90 v11.12,14.38
  Top 1.016: v9.6,20.11 9.65,20.06 RN2483.21 | RN2483.26 v11.18,12.32 v11.18,12.31 | RN2483.27 v11.18,11.05 v11.18,11.04 | RN2483.28 10.92,7.45 arc-90 v10.93,7.46 | RN2483.33 17.27,7.39 arc-90 v17.25,7.41
  Bottom 0.305: IC6.2 13.81,10.38 arc-90 v13.82,10.39 | D4.C 11.38,27.29 arc90 12.23,26.43 v12.93,26.43 | v15.99,25.47 arc90 15.32,24.8 IC4.18 15.32,21.91 arc-90 16.32,20.91 IC4.2 16.32,17.9 arc90 16.75,17.48 18.12,17.48 arc90 18.66,18.02 18.66,20.11 arc-90 v18.94,20.38 | IC4.19 15.82,23.9 arc-90 16.98,25.07 17.33,25.07 v17.39,25.13 | C7.2 13.57,15.2 v13.46,15.3 | C9.2 13.51,12.83 v13.5,12.82
  Bottom 0.406: v32,12.81 arc-90 33.36,14.17 USB.5
  Bottom 0.61: 2.35,24.87 ANT2.GND
  Bottom 0.813: D3.C v25.58,7.86 arc90 v25.58,7.86 | D9.C 27.37,7.85 arc90 27.35,7.86 | D1.C arc-90 29.1,6.89 v29.1,7.86
  Bottom 1.016: C8.2 11.22,15.79 arc-90 v11.4,15.62
  pour Top (isolate 0.406): -1.4,31.45 -1.4,-0.38 45.54,-0.38 45.54,31.45
  pour Route2 (isolate 0.406): -1.05,32.07 -1.05,-1.5 44.17,-1.5 44.17,32.07
  pour Route15 (isolate 0.406): -0.7,31.7 -0.7,-0.84 45.08,-0.84 45.08,31.7
  pour Bottom: -1.22,30.62 -1.22,-1.13 0.05,-2.4 43.23,-2.4 44.5,-1.13 44.5,30.62 43.23,31.89 0.05,31.89
GPIO_2  (via drill 0.35)
  Top 0.508: v26.38,1.4 24.89,1.4 arc-90 23.69,2.61 23.69,3.02 arc90 22.96,3.75 arc-90 22.35,4.36 RN2483.37
  Bottom 0.508: v26.38,1.4 25.61,2.17 arc90 R14.2
GPIO_3  (via drill 0.35)
  Top 0.508: v28.34,1.42 arc90 27.42,2.34 24.98,2.34 arc-90 24.51,2.81 24.51,3.77 arc90 24.18,4.1 arc-90 23.62,4.67 RN2483.38
  Bottom 0.508: R15.2 27.36,2.17 28.11,1.42 v28.34,1.42
GPIO_4  (via drill 0.35)
  Top 0.508: v30.05,1.4 arc90 28.32,3.13 25.68,3.13 arc-90 25.52,3.29 25.52,4.19 arc90 25.05,4.66 arc-90 24.89,4.83 RN2483.39
  Bottom 0.508: R16.2 29.18,2.17 29.94,1.4 v30.05,1.4
GPIO_6
  Top 0.508: RN2483.43 29.97,5.39 arc90 32.67,2.68 SV4.1
GPIO_7  (via drill 0.35)
  Top 0.813: RN2483.44 31.24,7.84 arc-90 v31.26,7.86
  Bottom 0.406: v31.26,7.86 32.72,7.86 arc-90 34.33,6.25 34.33,3.63 arc90 SV4.2
GPIO_8
  Top 0.305: RN2483.45 arc90 33.76,4.72 35.78,4.72 arc-90 SV4.3
GPIO_9
  Top 0.305: RN2483.46 33.78,8.06 36.76,8.06 arc-90 39.84,4.99 39.84,3.2 arc90 SV4.4
N$53
  Bottom 0.508: R14.1 25.61,5.32 D3.A
N$55
  Bottom 0.61: D1.A arc-90 29.18,5.32 R16.1
N$68
  Bottom 0.305: 10.77,28.82 arc-90 D4.A arc-90 10.77,28.82 | R18.1 10.77,28.82
PCG_INT
  Top 0.508: RN2483.30 arc-90 12,4.52 11.67,4.52 arc90 10.68,3.53 SV2.2
PGD_INT
  Top 0.406: RN2483.31 14.73,4.18 arc-90 SV2.3
RADIO_CTS  (via drill 0.35)
  Top 0.305: v31.71,28.01 31.71,27.59 arc90 32.07,27.23 arc-90 32.51,26.8 RN2483.3
  Bottom 0.305: IC4.23 18.2,22.15 arc90 18.48,22.43 18.48,22.75 arc-90 19.09,23.36 24.63,23.36 arc90 26.78,25.51 26.78,26.49 arc-90 28.31,28.03 31.7,28.03 arc-90 v31.71,28.01
RADIO_RTS  (via drill 0.35)
  Top 0.305: v32.74,28.46 32.74,27.97 arc90 33.38,27.33 arc-90 33.78,26.93 RN2483.2
  Bottom 0.305: IC4.22 17.67,23.45 arc-90 18.12,23.91 24.68,23.91 arc90 26.21,25.44 26.21,27.08 arc-90 27.92,28.79 32.41,28.79 v32.74,28.46
RADIO_RX  (via drill 0.35)
  Top 0.305: v28.16,25.84 28.07,25.84 arc90 27.43,25.19 | 27.43,25.19 27.43,25.96 23.06,25.96 arc-90 21.84,27.19 J2.2 | 27.43,25.19 RN2483.7
  Bottom 0.305: IC4.25 18.68,21.15 arc90 19.48,21.95 19.48,22.04 arc-90 19.78,22.34 25.03,22.34 arc90 27.97,25.28 27.97,25.65 arc-90 v28.16,25.84 28.41,25.59 32.76,25.59 arc90 35.13,27.96 arc-90 35.28,28.11 37.64,28.11 arc-90 37.87,27.88 R9.1
RADIO_TX  (via drill 0.35)
  Top 0.305: RN2483.6 28.82,23.88 28.82,24.81 arc-90 29.1,25.09 arc90 29.36,25.35 v29.36,27.12 29.31,27.17 24.91,27.17 arc-90 J2.1
  Bottom 0.305: IC4.24 18.34,21.65 arc90 18.97,22.28 18.97,22.52 arc-90 19.29,22.84 24.84,22.84 arc90 27.38,25.38 27.38,26.24 arc-90 28.25,27.12 v29.36,27.12 30.1,27.12 arc-90 30.54,26.68 arc90 31.11,26.11 32.59,26.11 arc90 34.51,28.03 arc-90 35.24,28.76 38.68,28.76 arc-90 R1.1
RFH
  Top 0.305: R20.2 arc-90 2.43,17.73 ANT2.RF
  Top 0.813: RN2483.23 9.65,16.28 arc-90 3.56,22.37 ANT2.RF
RFL
  Top 0.305: R19.2 arc90 2.43,13.4 ANT1.RF
  Top 0.813: ANT1.RF 3.94,8.62 arc-90 8.91,13.59 RN2483.25
RN2483_RESET  (via drill 0.35)
  Top 0.508: RN2483.32 16,8.21 arc-90 v16.97,9.18
  Bottom 0.508: v16.97,9.18 19.13,9.18 | R12.2 arc-90 19.13,12.51 19.13,9.18 | 19.13,9.18 arc90 19.74,8.57 20.21,8.57 arc-90 20.84,7.94 SV2.6
SUSPEND
  Bottom 0.305: R18.2 arc90 9.94,26.12 10,26.12 arc-90 11.26,24.86 11.26,22.19 arc90 11.77,21.68 12.93,21.68 arc-90 IC4.12
V_BUS  (via drill 0.35)
  Top 0.305: v13,17.16 arc90 12.25,16.42 12.25,15.28 arc90 v13.5,14.03 arc90 12.38,12.92 v12.38,10.39
  Bottom 0.305: IC4.8 arc-90 12.94,19.62 12.94,18.88 | 12.94,18.88 arc-90 12.71,18.65 | 12.94,18.49 12.94,18.88 | IC4.7 13.52,18.49 12.94,18.49 | 12.94,18.49 12.94,17.22 arc90 v13,17.16 | IC6.1 12.86,9.92 arc90 v12.38,10.39 | v13.5,14.03 13.52,14.01 26.5,14.01 arc90 27.54,15.05 27.54,16.81 arc-90 29.31,18.58 31.86,18.58 arc90 v32,18.44
  Bottom 0.406: USB.1 33.67,16.77 arc-90 v32,18.44
  Bottom 0.508: R17.1 29.56,20.88 arc-90 v32,18.44 32,20.53 33.48,22 | 33.48,22 33.48,23.43 arc-90 35.45,25.4 R9.2 | 33.48,22 33.66,22.19 arc-90 35.32,23.85 36.05,23.85
  Bottom 0.61: C8.1 arc-90 11.34,18.65 12.71,18.65 | 40.56,25.4 arc-90 39.02,23.85 36.05,23.85
  Bottom 0.813: 40.56,25.4 R1.2 arc90 R1.2

### Text on the board
tPlace: 868 MHZ | R20 | TERMINATION / POINTS | R19 | 433 MHZ
bPlace: TX RX B_DEBUG SUSPEND | 686 MHZ | 433 MHZ | ICSP | R_DEBUG